# Altium schematic sheet S7CAS-PLEIADES-CARTE-MERE_P06_FPGA5.SCHDOC
size Tabloid; SheetNumber: 9; SheetTotal: 18; Sheet_Name: FPGA5; Size: 11x17
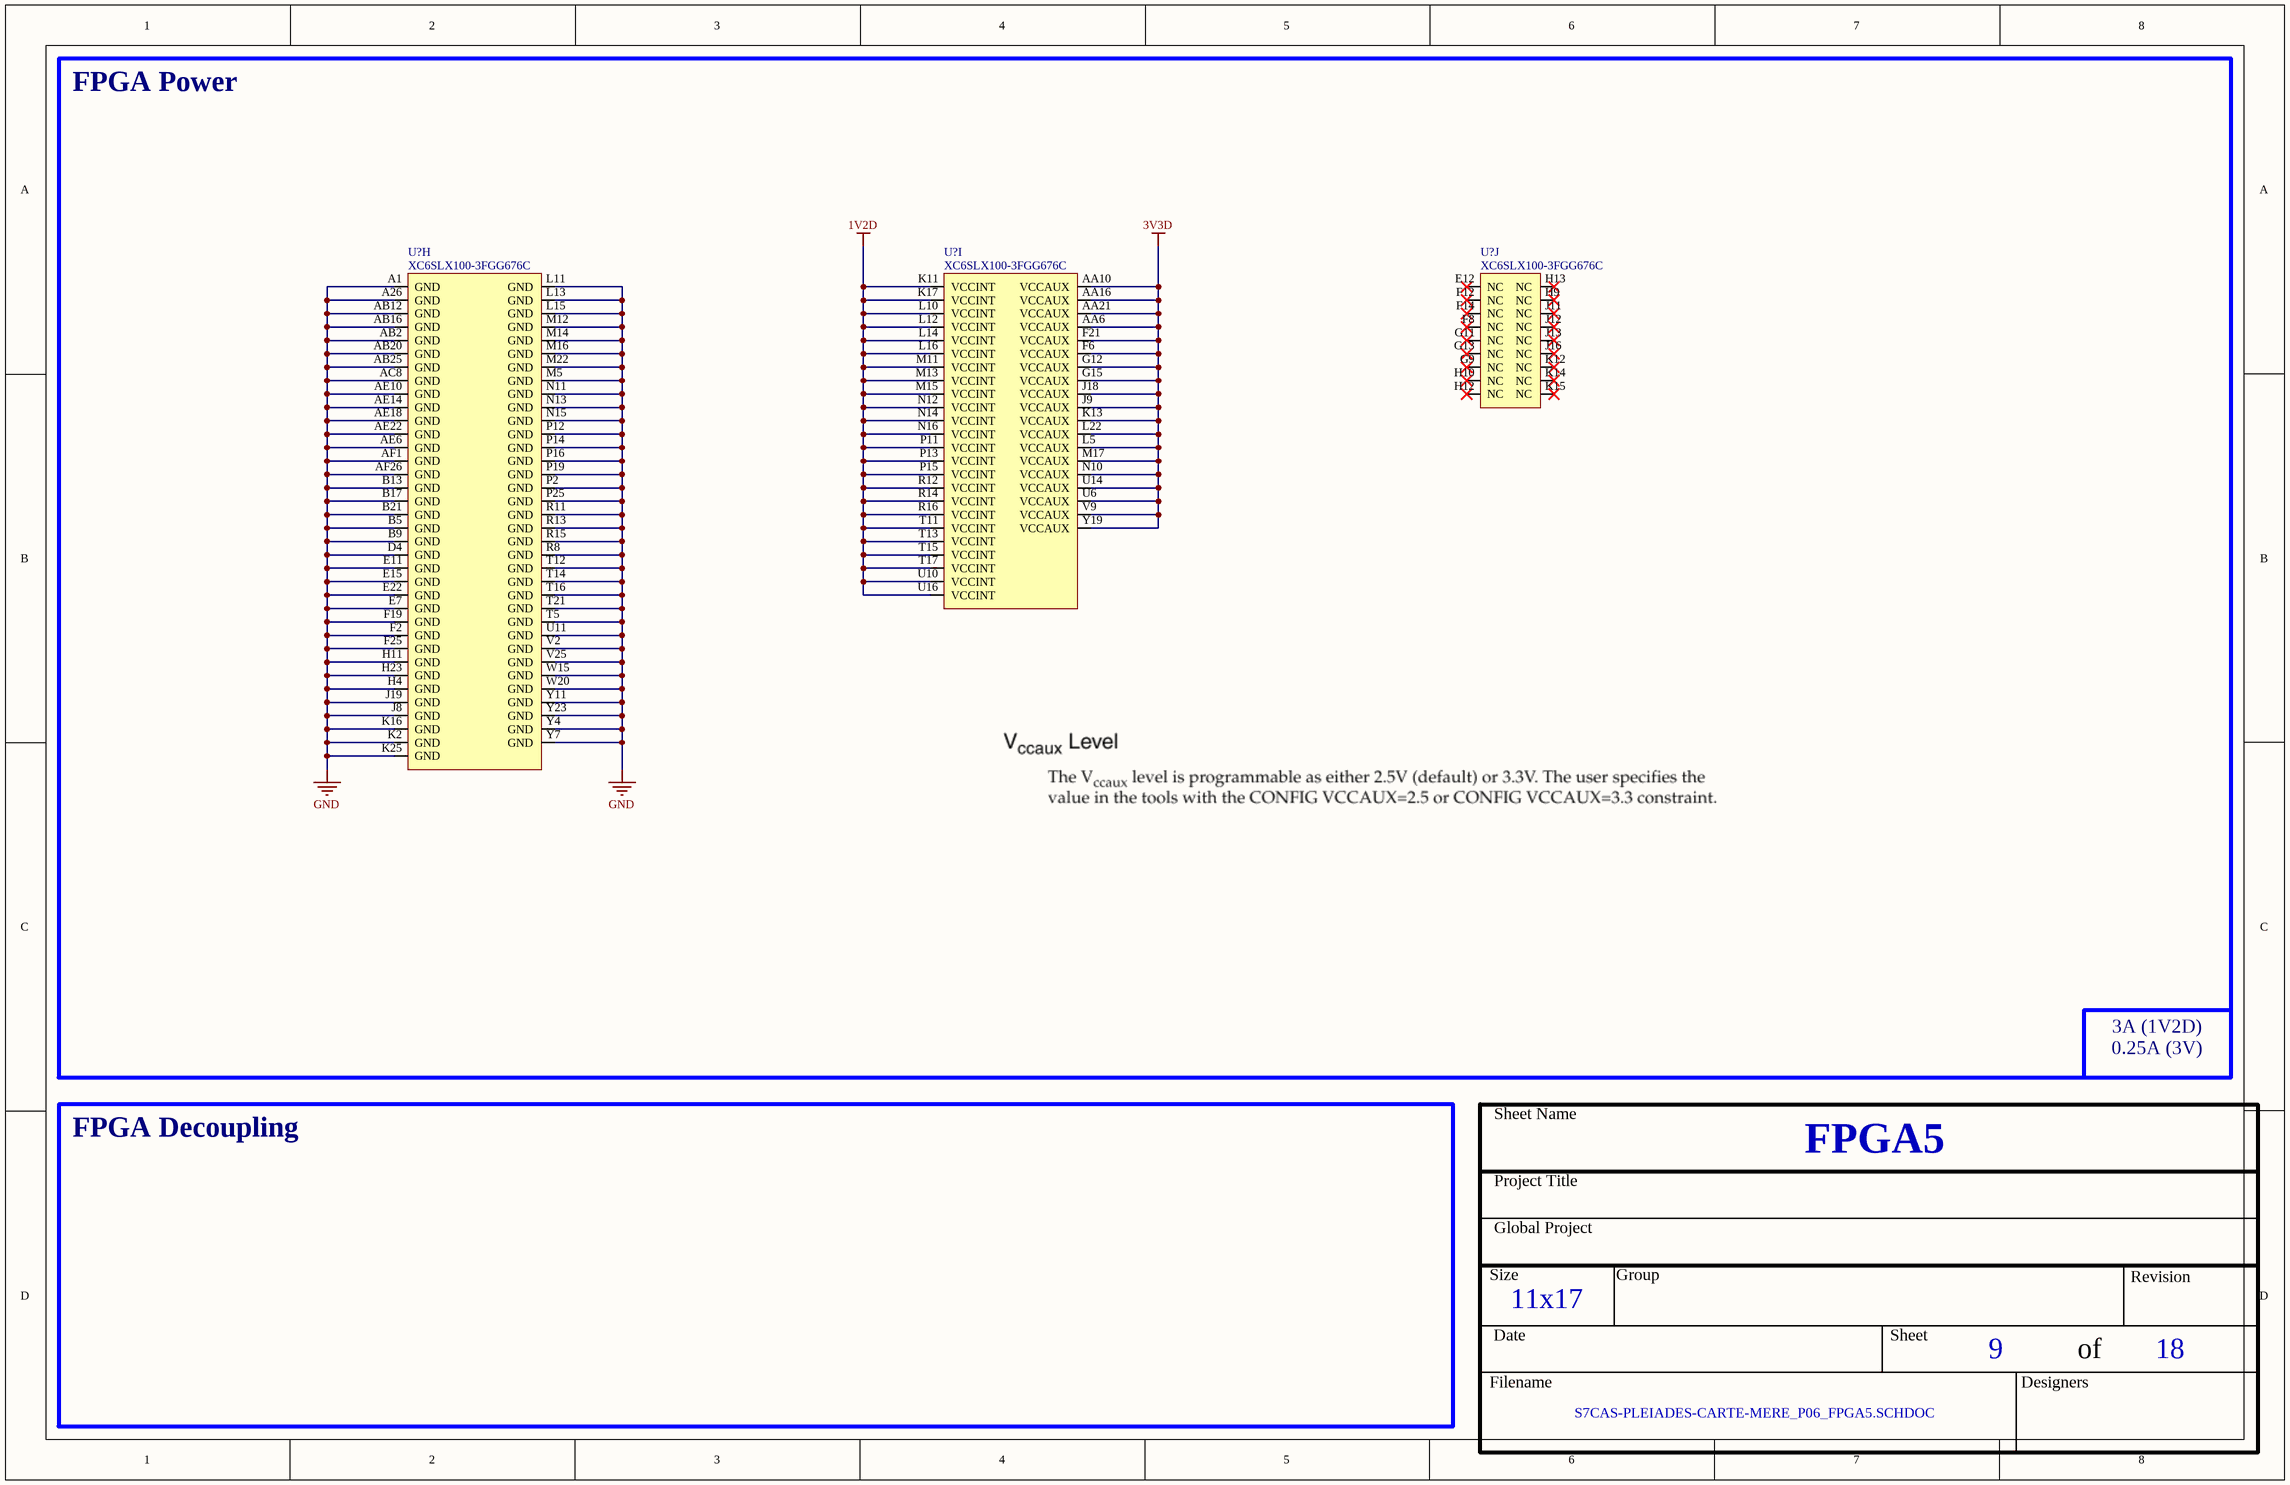
[diagram p0: S7CAS-PLEIADES-CARTE-MERE_P06_FPGA5.SCHDOC]

## Parts
(Parts that share a designator on the sheet are numbered #1, #2 ... from top to bottom, then left to right.)
U?#1  XC6SLX100-3FGG676C  [FPGA_XILINX_FGG676]  (part H of 10)
U?#2  XC6SLX100-3FGG676C  [FPGA_XILINX_FGG676]  (part I of 10)
U?#3  XC6SLX100-3FGG676C  [FPGA_XILINX_FGG676]  (part J of 10)

## Blocks framed on the sheet
FPGA Power: U?#1-U?#3

## Nets
1V2D: U?#2.K11(VCCINT) U?#2.K17(VCCINT) U?#2.L10(VCCINT) U?#2.L12(VCCINT) U?#2.L14(VCCINT) U?#2.L16(VCCINT) U?#2.M11(VCCINT) U?#2.M13(VCCINT) U?#2.M15(VCCINT) U?#2.N12(VCCINT) U?#2.N14(VCCINT) U?#2.N16(VCCINT) U?#2.P11(VCCINT) U?#2.P13(VCCINT) U?#2.P15(VCCINT) U?#2.R12(VCCINT) U?#2.R14(VCCINT) U?#2.R16(VCCINT) U?#2.T11(VCCINT) U?#2.T13(VCCINT) U?#2.T15(VCCINT) U?#2.T17(VCCINT) U?#2.U10(VCCINT) U?#2.U16(VCCINT)
3V3D: U?#2.AA6(VCCAUX) U?#2.AA10(VCCAUX) U?#2.AA16(VCCAUX) U?#2.AA21(VCCAUX) U?#2.F6(VCCAUX) U?#2.F21(VCCAUX) U?#2.G12(VCCAUX) U?#2.G15(VCCAUX) U?#2.J9(VCCAUX) U?#2.J18(VCCAUX) U?#2.K13(VCCAUX) U?#2.L5(VCCAUX) U?#2.L22(VCCAUX) U?#2.M17(VCCAUX) U?#2.N10(VCCAUX) U?#2.U6(VCCAUX) U?#2.U14(VCCAUX) U?#2.V9(VCCAUX) U?#2.Y19(VCCAUX)
GND: U?#1.A1(GND) U?#1.A26(GND) U?#1.AB2(GND) U?#1.AB12(GND) U?#1.AB16(GND) U?#1.AB20(GND) U?#1.AB25(GND) U?#1.AC8(GND) U?#1.AE6(GND) U?#1.AE10(GND) U?#1.AE14(GND) U?#1.AE18(GND) U?#1.AE22(GND) U?#1.AF1(GND) U?#1.AF26(GND) U?#1.B5(GND) U?#1.B9(GND) U?#1.B13(GND) U?#1.B17(GND) U?#1.B21(GND) U?#1.D4(GND) U?#1.E7(GND) U?#1.E11(GND) U?#1.E15(GND) U?#1.E22(GND) U?#1.F2(GND) U?#1.F19(GND) U?#1.F25(GND) U?#1.H4(GND) U?#1.H11(GND) U?#1.H23(GND) U?#1.J8(GND) U?#1.J19(GND) U?#1.K2(GND) U?#1.K16(GND) U?#1.K25(GND) U?#1.L11(GND) U?#1.L13(GND) U?#1.L15(GND) U?#1.M5(GND) U?#1.M12(GND) U?#1.M14(GND) U?#1.M16(GND) U?#1.M22(GND) U?#1.N11(GND) U?#1.N13(GND) U?#1.N15(GND) U?#1.P2(GND) U?#1.P12(GND) U?#1.P14(GND) U?#1.P16(GND) U?#1.P19(GND) U?#1.P25(GND) U?#1.R8(GND) U?#1.R11(GND) U?#1.R13(GND) U?#1.R15(GND) U?#1.T5(GND) U?#1.T12(GND) U?#1.T14(GND) U?#1.T16(GND) U?#1.T21(GND) U?#1.U11(GND) U?#1.V2(GND) U?#1.V25(GND) U?#1.W15(GND) U?#1.W20(GND) U?#1.Y4(GND) U?#1.Y7(GND) U?#1.Y11(GND) U?#1.Y23(GND)

Not connected (* = marked no-connect by the designer): U?#3 E12(NC)* F8(NC)* F12(NC)* F14(NC)* G9(NC)* G11(NC)* G13(NC)* H9(NC)* H10(NC)* H12(NC)* H13(NC)* J11(NC)* J12(NC)* J13(NC)* J16(NC)* K12(NC)* K14(NC)* K15(NC)*

## Notes on the sheet
- 3A (1V2D)
  0.25A (3V)
- FPGA Decoupling
- Sheet Name
- Project Title
- Global Project
- Size
- Group
- Revision
- Date
- Sheet
- of
- Filename
- Designers

## Library data of the parts
U?#1-U?#3 = FPGA_XC6SLX100-3FGG676C: FPGA - XILINX SPARTAN 6 480 I/O - BGA-676; Voltage: 1.14 V ~ 1.26 V; Current: *; Power: *; Mfg: Xilinx; Mfg Part Number: XC6SLX100-3FGG676C; HelpURL: https://www.xilinx.com/support/documentation/data_sheets/ds162.pdf; CreatedBy: Jonathan Bouchard; Temperature: 0°C ~ 85°C (TJ); Value: *; Precision: *; Package: BGA-676; Supplier 1: Digikey; Supplier Part Number 1: 122-1760-ND